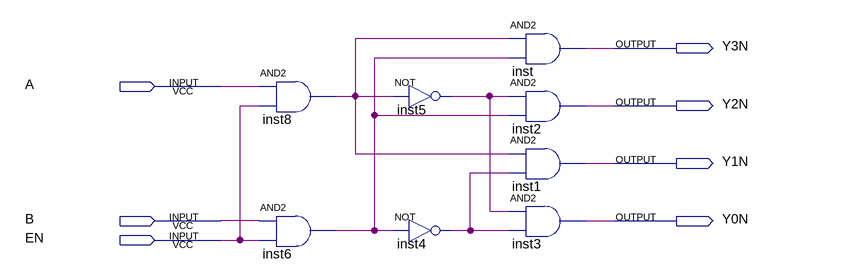
[diagram p0: schematic sheet]
// Quartus schematic DECODER.bdf as structural Verilog: 8 symbols, 7 pins
module DECODER (
  input  A,
  input  B,
  input  EN,
  output Y3N,
  output Y2N,
  output Y1N,
  output Y0N
);

  wire inst4_out, inst5_out, inst6_out, inst8_out;

  and inst8 (inst8_out, A, EN);
  and inst6 (inst6_out, B, EN);
  not inst5 (inst5_out, inst8_out);
  not inst4 (inst4_out, inst6_out);
  and inst (Y3N, inst8_out, inst6_out);
  and inst2 (Y2N, inst5_out, inst6_out);
  and inst1 (Y1N, inst8_out, inst4_out);
  and inst3 (Y0N, inst5_out, inst4_out);
endmodule
